# EAGLE design tssop16 (EAGLE 9.2.2)
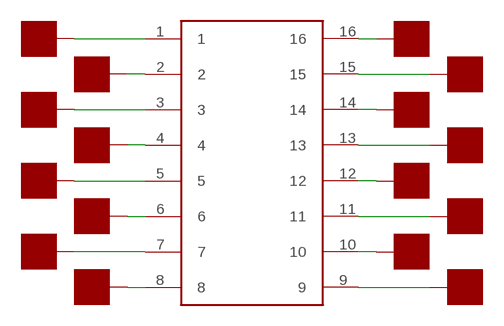
[diagram p0: schematic, sheet 1]

## Parts
IC1  TSSOP-16  [TSSOP-16]
U$1  PAD50MIL  [PAD_50MIL]
U$2  PAD50MIL  [PAD_50MIL]
U$3  PAD50MIL  [PAD_50MIL]
U$4  PAD50MIL  [PAD_50MIL]
U$5  PAD50MIL  [PAD_50MIL]
U$6  PAD50MIL  [PAD_50MIL]
U$7  PAD50MIL  [PAD_50MIL]
U$8  PAD50MIL  [PAD_50MIL]
U$9  PAD50MIL  [PAD_50MIL]
U$10  PAD50MIL  [PAD_50MIL]
U$11  PAD50MIL  [PAD_50MIL]
U$12  PAD50MIL  [PAD_50MIL]
U$13  PAD50MIL  [PAD_50MIL]
U$14  PAD50MIL  [PAD_50MIL]
U$15  PAD50MIL  [PAD_50MIL]
U$16  PAD50MIL  [PAD_50MIL]

## Nets
N$1: IC1.1 U$16.P$1
N$2: IC1.2 U$15.P$1
N$3: IC1.3 U$14.P$1
N$4: IC1.4 U$13.P$1
N$5: IC1.5 U$12.P$1
N$6: IC1.6 U$11.P$1
N$7: IC1.7 U$10.P$1
N$8: IC1.8 U$9.P$1
N$9: IC1.9 U$8.P$1
N$10: IC1.10 U$7.P$1
N$11: IC1.11 U$6.P$1
N$12: IC1.12 U$5.P$1
N$13: IC1.13 U$4.P$1
N$14: IC1.14 U$3.P$1
N$15: IC1.15 U$2.P$1
N$16: IC1.16 U$1.P$1

## Library data of the parts
IC1 = yapo:TSSOP-16
U$1-U$16 = yapo:PAD

## Board
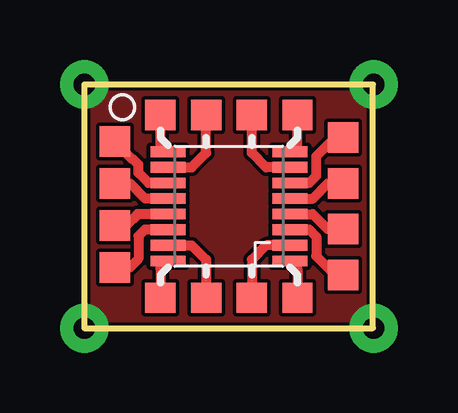
[diagram p1: board, top side]
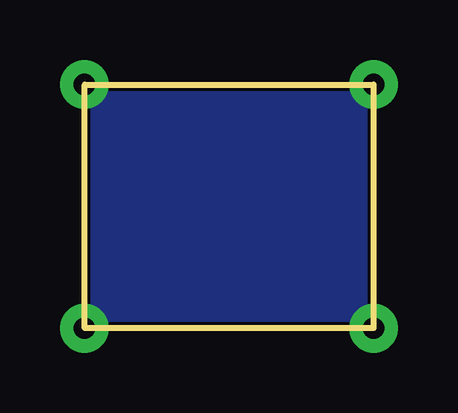
[diagram p2: board, bottom side, seen from below]

Size 12.04 x 10.15 mm. Coordinates in mm from the lower left corner, seen from the top.
Outline: 0,0 12.04,0 12.04,10.15 0,10.15 0,0
Copper layers (1*16): Top 0.035559375mm / dielectric 1.6mm / Bottom 0.035559375mm
Design rules "oshpark-2layer *": minimum track width 6mil, minimum drill 10mil, track to track 6mil, track to pad 6mil, pad to pad 6mil, via to via 6mil, smd to smd 6mil, copper to edge 5mil, drill to drill 6mil, minimum pad ring 5mil, minimum via ring 5mil, stop-mask expansion 2.5mil, vias tented up to drill 0mil, thermal gap 10mil

### Footprints (pad centres in the part's own frame; a part is rotated, then mirrored left to right if it is on the bottom)
TSSOP-16 = smd 0.45 x 1.5: 1 -2.275,-2.54; 2 -1.625,-2.54; 3 -0.975,-2.54; 4 -0.325,-2.54; 5 0.325,-2.54; 6 0.975,-2.54; 7 1.625,-2.54; 8 2.275,-2.54; 9 2.275,2.54; 10 1.625,2.54; 11 0.975,2.54; 12 0.325,2.54; 13 -0.325,2.54; 14 -0.975,2.54; 15 -1.625,2.54; 16 -2.275,2.54
PAD_50MIL = smd 1.27 x 1.27: P$1 0,0

### Placement (x,y rotation side)
IC1  6.03,5.08 90 top
U$1  3.17,1.27 0 top
U$2  5.08,1.27 0 top
U$3  1.27,2.54 0 top
U$4  1.27,4.29 0 top
U$5  1.27,6.03 0 top
U$6  1.27,7.78 0 top
U$7  5.08,8.89 0 top
U$8  3.17,8.89 0 top
U$9  8.89,8.89 0 top
U$10  6.99,8.89 0 top
U$11  10.79,7.94 0 top
U$12  10.79,6.03 0 top
U$13  10.79,4.13 0 top
U$14  10.79,2.22 0 top
U$15  6.99,1.27 0 top
U$16  8.89,1.27 0 top

### Tracks (layer width: path | path; a pad name or v marks a point on that pad's centre or on a via)
GND  (via drill 0.89 pad 2.03)  (3 unrouted)
  other vias: 0,10.16 12.06,10.16 12.06,0 0,0
  pour Top (no thermals): 0,10.16 12.06,10.16 12.06,0 0,0
  pour Bottom (no thermals): 0,10.16 12.06,10.16 12.06,0 0,0
N$1
  Top 0.406: IC1.1 8.89,2.49 U$16.P$1
N$2
  Top 0.406: IC1.2 7.58,3.46 6.99,2.86 U$15.P$1
N$3
  Top 0.406: U$14.P$1 10.46,2.22 9.68,3 9.68,3.81 9.39,4.11 IC1.3
N$4
  Top 0.406: IC1.4 9.53,4.75 10.16,4.13 U$13.P$1
N$5
  Top 0.406: IC1.5 9.53,5.41 10.16,6.03 U$12.P$1
N$6
  Top 0.406: U$11.P$1 10.46,7.94 9.68,7.16 9.68,6.35 9.39,6.05 IC1.6
N$7
  Top 0.406: IC1.7 7.58,6.71 6.99,7.3 U$10.P$1
N$8
  Top 0.406: IC1.8 8.89,7.67 U$9.P$1
N$9
  Top 0.406: IC1.9 3.17,7.67 U$8.P$1
N$10
  Top 0.406: IC1.10 4.48,6.71 5.08,7.3 U$7.P$1
N$11
  Top 0.406: 1.59,7.46 U$6.P$1 2.03,7.02 2.05,7.02 2.26,6.82 2.26,6.47 2.68,6.05 IC1.11
N$12
  Top 0.406: IC1.12 2.54,5.41 1.91,6.03 U$5.P$1
N$13
  Top 0.406: IC1.13 2.21,4.75 1.75,4.29 U$4.P$1
N$14
  Top 0.406: IC1.14 2.52,4.11 2.26,3.85 2.26,2.9 1.91,2.54 U$3.P$1
N$15
  Top 0.406: IC1.15 4.48,3.46 5.08,2.86 U$2.P$1
N$16
  Top 0.406: IC1.16 3.17,2.49 U$1.P$1